# EAGLE schematic Linear VCA chip v1.1 (EAGLE 6.2)
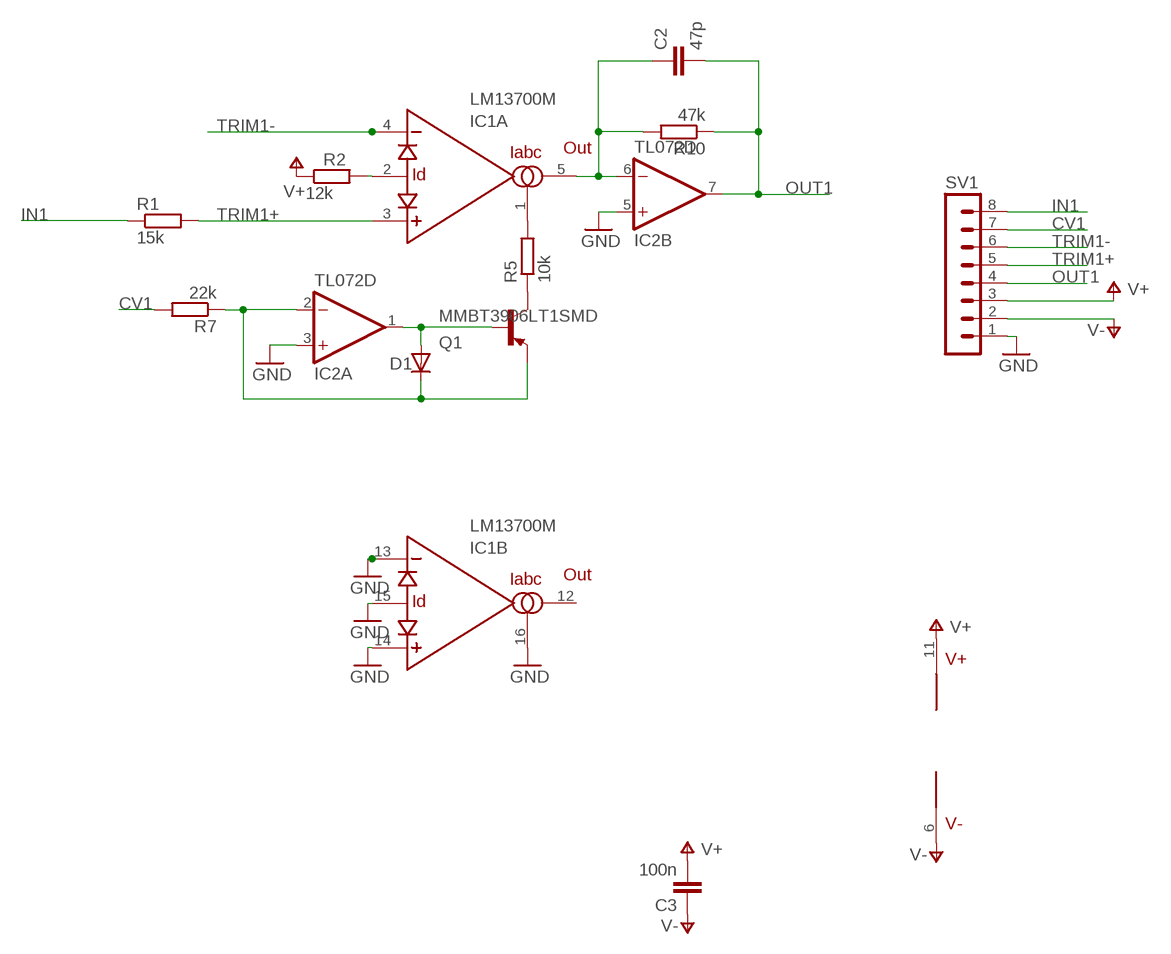
[diagram p0: schematic, sheet 1]

## Parts
C2  47p  C-EUC0805  [C0805]
C3  100n  C-EUC0805  [C0805]
D1  DIODE-SOD80C  [SOD80C]
IC1  LM13700M  [SO16]
IC2  TL072D  [SO08]
Q1  MMBT3906LT1SMD  [SOT23-BEC]
R1  15k  R-EU_R0805  [R0805]
R2  12k  R-EU_R0805  [R0805]
R5  10k  R-EU_R0805  [R0805]
R7  22k  R-EU_R0805  [R0805]
R10  47k  R-EU_R0805  [R0805]
SV1  MA08-1  [MA08-1]

## Nets
CV1: R7.2 SV1.7
GND: IC1.13(B:-IN) IC1.14(B:+IN) IC1.15(B:ID) IC1.16(B:IABC) IC2.3(A:+IN) IC2.5(B:+IN) SV1.1
IN1: R1.1 SV1.8
N$1: Q1.C R5.1
N$3: D1.C IC2.2(A:-IN) Q1.E R7.1
N$4: IC1.1(A:IABC) R5.2
N$6: IC1.2(A:ID) R2.2
N$9: C2.1 IC1.5(A:OUT) IC2.6(B:-IN) R10.2
N$10: D1.A IC2.1(A:OUT) Q1.B
OUT1: C2.2 IC2.7(B:OUT) R10.1 SV1.4
TRIM1+: IC1.3(A:+IN) R1.2 SV1.5
TRIM1-: IC1.4(A:-IN) SV1.6
V+: C3.2 IC1.11(V+) R2.1 SV1.3
V-: C3.1 IC1.6(V-) SV1.2
Unconnected: IC1.7(IN) IC1.8(OUT) IC1.9(OUT) IC1.10(IN) IC1.12(B:OUT)

## Power pins joined to a net without a drawn wire
V+: IC2.8(P:V+)
V-: IC2.4(P:V-)

## Library data of the parts
C2 C3 = resistor:C-EU: CAPACITOR, European symbol
D1 = diode:DIODE-: DIODE
IC1 = synthdiy:LM13700: National Dual OTA with buffers.
IC2 = linear:TL072: OP AMP
Q1 = transistor-pnp:MMBT3906*: PNP Transistror
R1 R2 R5 R7 R10 = resistor:R-EU_: RESISTOR, European symbol
SV1 = con-lstb:MA08-1: PIN HEADER; OC_FARNELL: unknown; OC_NEWARK: unknown